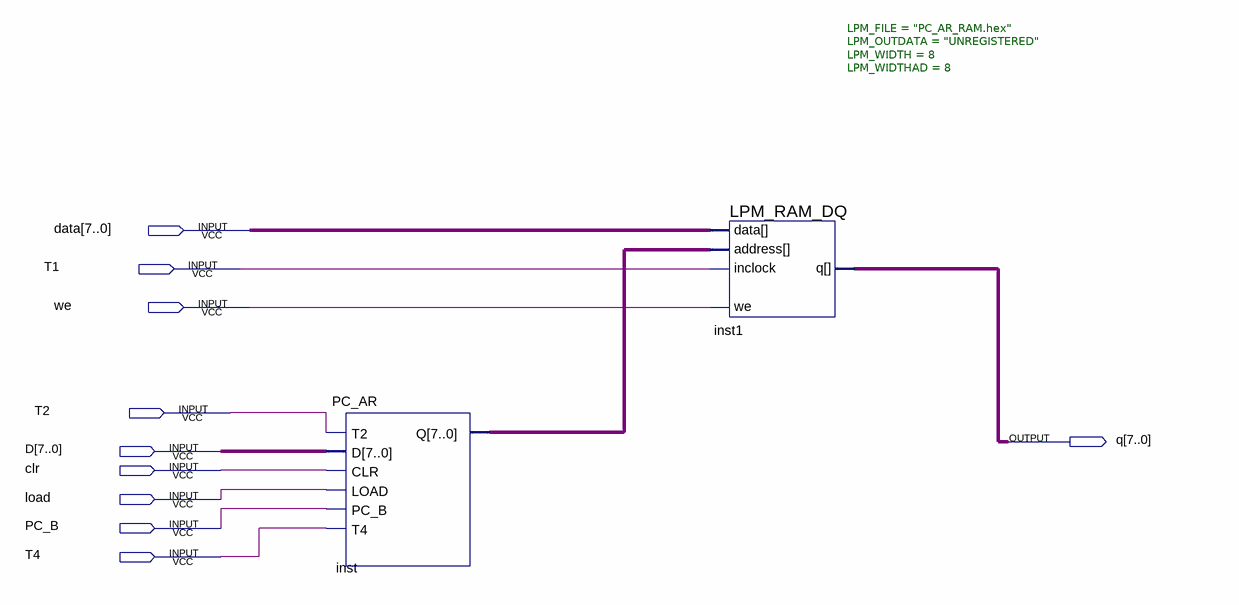
[diagram p0: schematic sheet]
// Quartus schematic PC_AR_RAM.bdf as structural Verilog: 2 symbols, 10 pins
module PC_AR_RAM (
  input  [7:0] data,
  input  T1,
  input  we,
  input  T2,
  input  [7:0] D,
  input  clr,
  input  load,
  input  PC_B,
  input  T4,
  output [7:0] q
);

  wire [7:0] inst_q;

  PC_AR inst (.T2(T2), .D(D), .CLR(clr), .LOAD(load), .PC_B(PC_B), .T4(T4), .Q(inst_q));
  LPM_RAM_DQ #(.LPM_FILE("PC_AR_RAM.hex"), .LPM_OUTDATA("UNREGISTERED"), .LPM_WIDTH(8), .LPM_WIDTHAD(8)) inst1 (
    .address(inst_q), .data(data), .inclock(T1), .we(we), .q(q));
endmodule
